# Altium schematic sheet Scheme.SchDoc
size 420 x 297 mm; ListNumber: 1
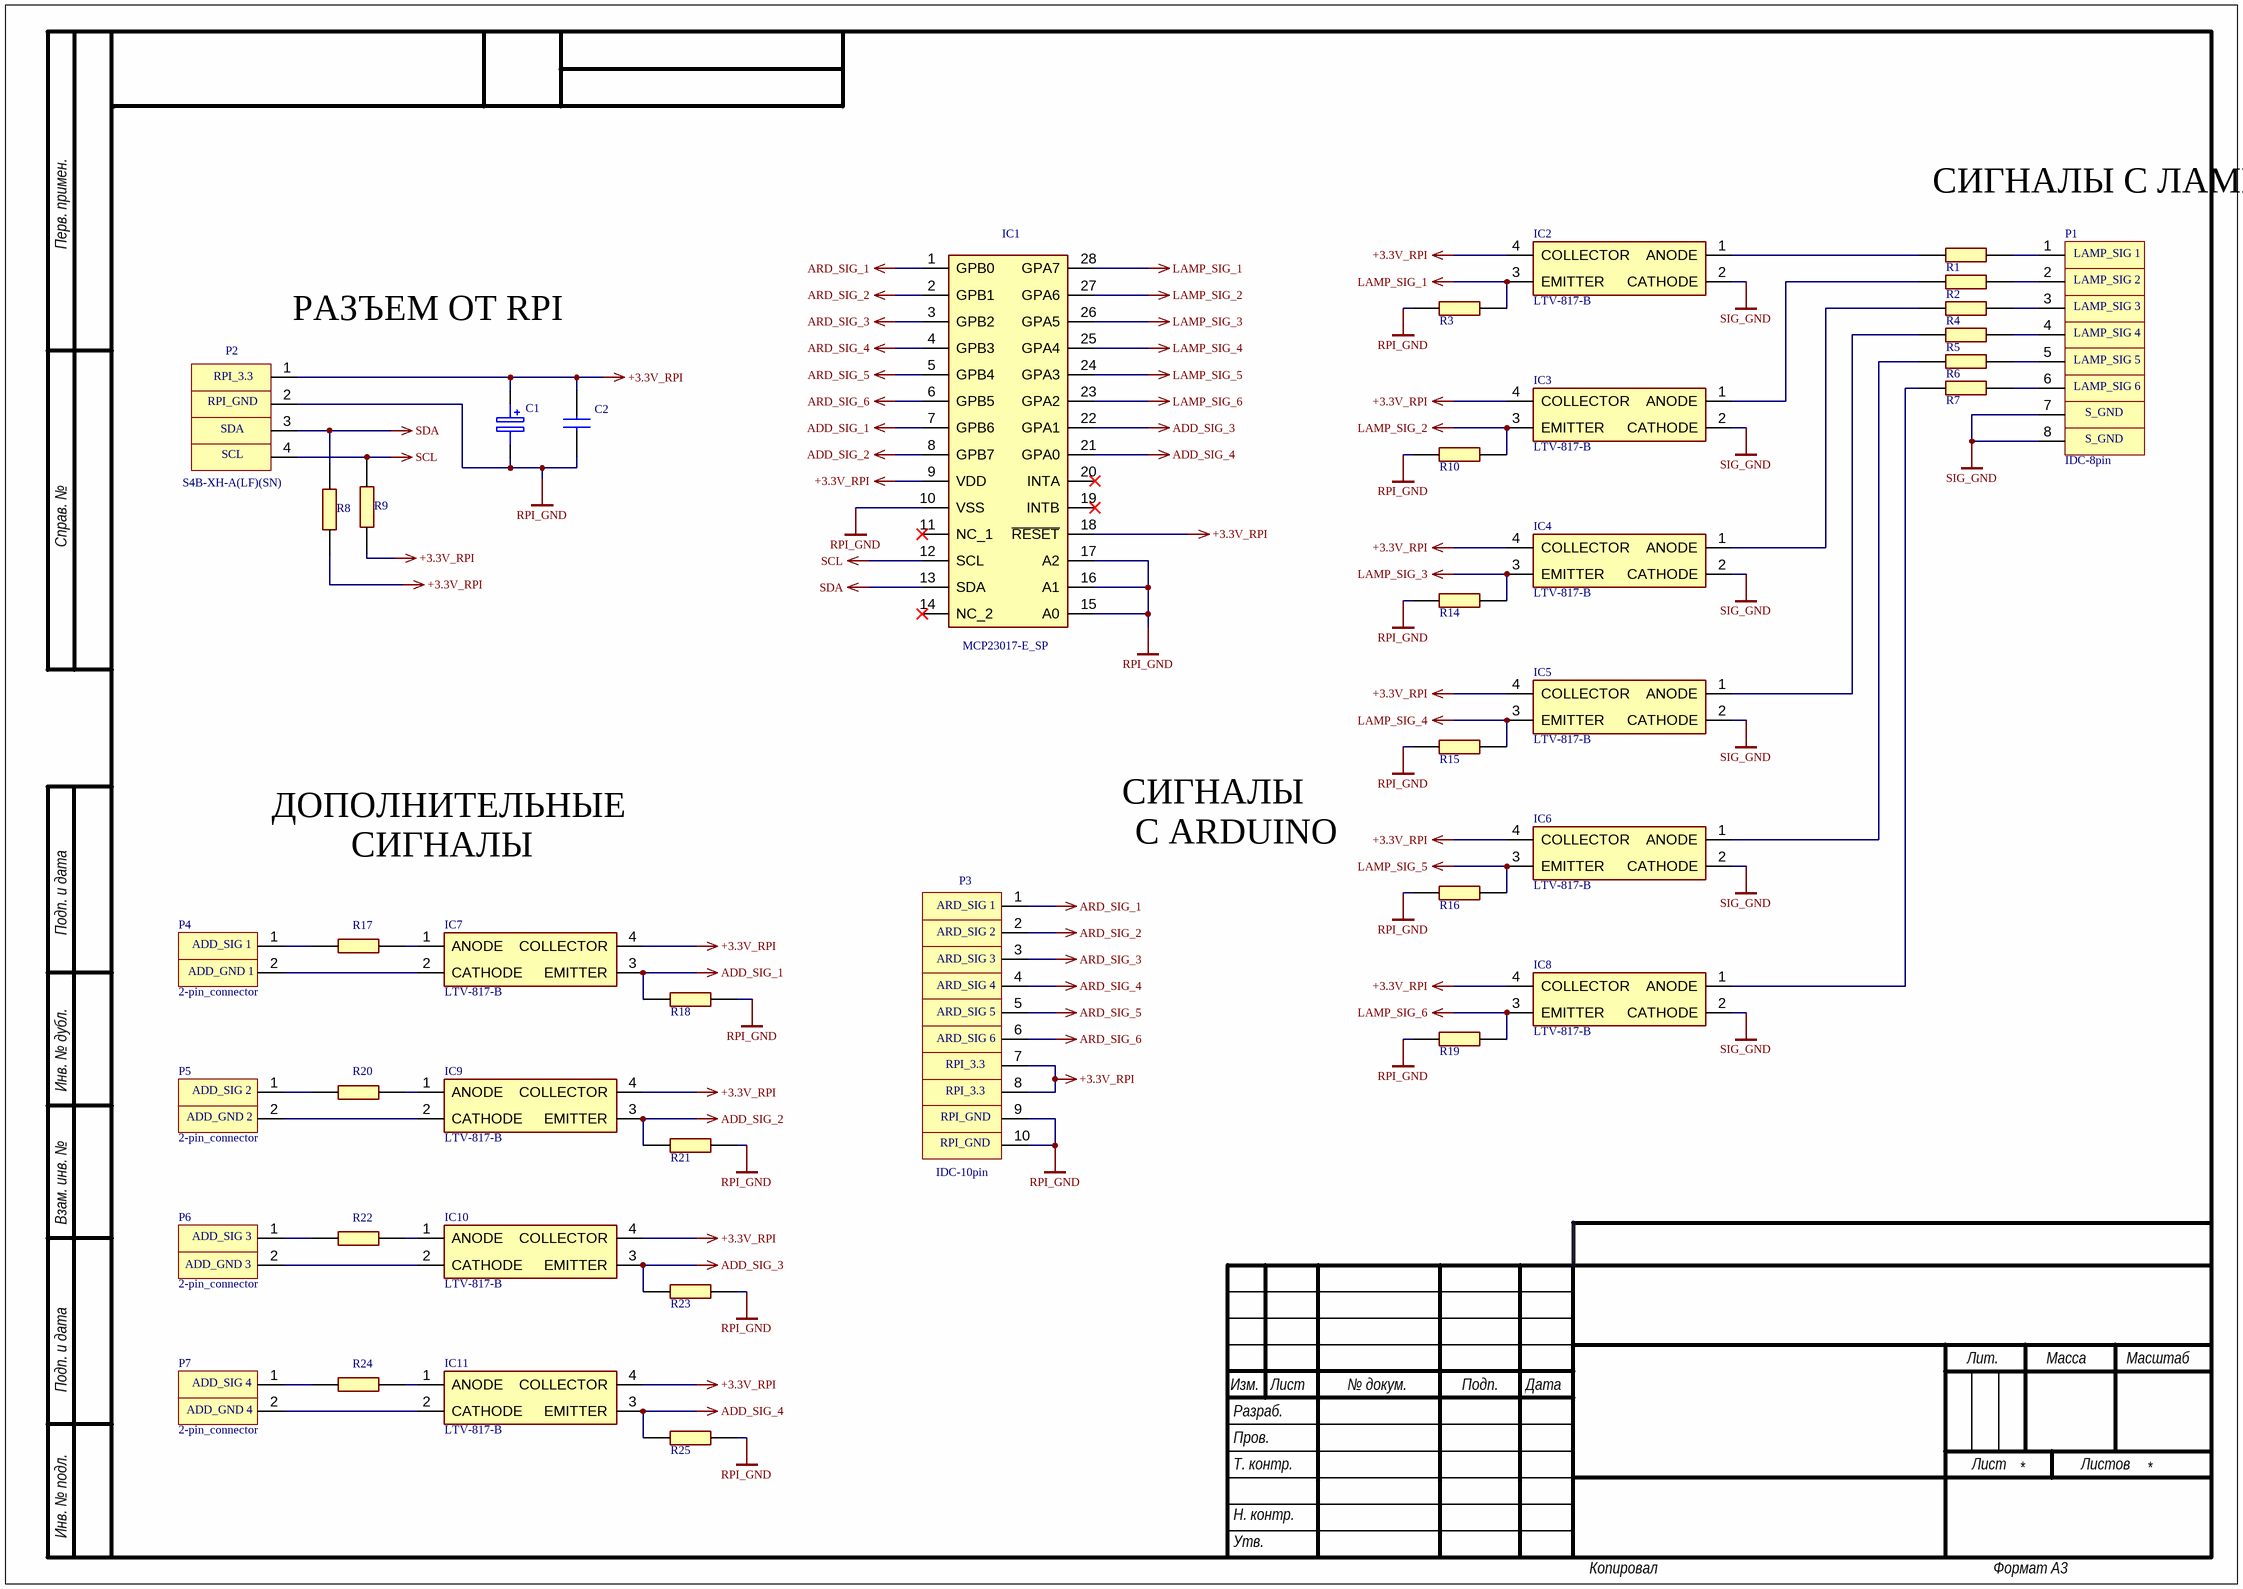
[diagram p0: Scheme.SchDoc]

## Parts
C1  EEU-FR1V330  [CAPPRD200W55D500H1250]  (value not drawn)
C2  C3216C0G1H683J160AE  [CAPC3216X180N]  (value not drawn)
IC1  MCP23017-E_SP  [DIP794W56P254L3486H508Q28N]
IC2  LTV-817-B  [DIP762W60P254L460H420Q4N]
IC3  LTV-817-B  [DIP762W60P254L460H420Q4N]
IC4  LTV-817-B  [DIP762W60P254L460H420Q4N]
IC5  LTV-817-B  [DIP762W60P254L460H420Q4N]
IC6  LTV-817-B  [DIP762W60P254L460H420Q4N]
IC7  LTV-817-B  [DIP762W60P254L460H420Q4N]
IC8  LTV-817-B  [DIP762W60P254L460H420Q4N]
IC9  LTV-817-B  [DIP762W60P254L460H420Q4N]
IC10  LTV-817-B  [DIP762W60P254L460H420Q4N]
IC11  LTV-817-B  [DIP762W60P254L460H420Q4N]
P1  IDC-8pin  [IDC-8pin]
P2  S4B-XH-A(LF)(SN)  [JST-S4B-XH-A(LF)(SN)_V]
P3  IDC-10pin  [IDC-10PIN]
P4  2-pin_connector  [2-pin_connector]
P5  2-pin_connector  [2-pin_connector]
P6  2-pin_connector  [2-pin_connector]
P7  2-pin_connector  [2-pin_connector]
R1  CR1206-FW-1504ELF  [RESC3216X75N]  (value not drawn)
R2  CR1206-FW-1504ELF  [RESC3216X75N]  (value not drawn)
R3  CR1206-FW-1504ELF  [RESC3216X75N]  (value not drawn)
R4  CR1206-FW-1504ELF  [RESC3216X75N]  (value not drawn)
R5  CR1206-FW-1504ELF  [RESC3216X75N]  (value not drawn)
R6  CR1206-FW-1504ELF  [RESC3216X75N]  (value not drawn)
R7  CR1206-FW-1504ELF  [RESC3216X75N]  (value not drawn)
R8  CR1206-FW-1504ELF  [RESC3216X75N]  (value not drawn)
R9  CR1206-FW-1504ELF  [RESC3216X75N]  (value not drawn)
R10  CR1206-FW-1504ELF  [RESC3216X75N]  (value not drawn)
R14  CR1206-FW-1504ELF  [RESC3216X75N]  (value not drawn)
R15  CR1206-FW-1504ELF  [RESC3216X75N]  (value not drawn)
R16  CR1206-FW-1504ELF  [RESC3216X75N]  (value not drawn)
R17  CR1206-FW-1504ELF  [RESC3216X75N]  (value not drawn)
R18  CR1206-FW-1504ELF  [RESC3216X75N]  (value not drawn)
R19  CR1206-FW-1504ELF  [RESC3216X75N]  (value not drawn)
R20  CR1206-FW-1504ELF  [RESC3216X75N]  (value not drawn)
R21  CR1206-FW-1504ELF  [RESC3216X75N]  (value not drawn)
R22  CR1206-FW-1504ELF  [RESC3216X75N]  (value not drawn)
R23  CR1206-FW-1504ELF  [RESC3216X75N]  (value not drawn)
R24  CR1206-FW-1504ELF  [RESC3216X75N]  (value not drawn)
R25  CR1206-FW-1504ELF  [RESC3216X75N]  (value not drawn)

## Nets
+3.3V_RPI: C1.1(+) C2.2 IC1.9(VDD) IC1.18(~{RESET}) IC2.4(COLLECTOR) IC3.4(COLLECTOR) IC4.4(COLLECTOR) IC5.4(COLLECTOR) IC6.4(COLLECTOR) IC7.4(COLLECTOR) IC8.4(COLLECTOR) IC9.4(COLLECTOR) IC10.4(COLLECTOR) IC11.4(COLLECTOR) P2.1 P3.7 P3.8 R8.2 R9.2
ADD_SIG_1: IC1.7(GPB6) IC7.3(EMITTER) R18.1
ADD_SIG_2: IC1.8(GPB7) IC9.3(EMITTER) R21.1
ADD_SIG_3: IC1.22(GPA1) IC10.3(EMITTER) R23.1
ADD_SIG_4: IC1.21(GPA0) IC11.3(EMITTER) R25.1
ARD_SIG_1: IC1.1(GPB0) P3.1
ARD_SIG_2: IC1.2(GPB1) P3.2
ARD_SIG_3: IC1.3(GPB2) P3.3
ARD_SIG_4: IC1.4(GPB3) P3.4
ARD_SIG_5: IC1.5(GPB4) P3.5
ARD_SIG_6: IC1.6(GPB5) P3.6
LAMP_SIG_1: IC1.28(GPA7) IC2.3(EMITTER) R3.1
LAMP_SIG_2: IC1.27(GPA6) IC3.3(EMITTER) R10.1
LAMP_SIG_3: IC1.26(GPA5) IC4.3(EMITTER) R14.1
LAMP_SIG_4: IC1.25(GPA4) IC5.3(EMITTER) R15.1
LAMP_SIG_5: IC1.24(GPA3) IC6.3(EMITTER) R16.1
LAMP_SIG_6: IC1.23(GPA2) IC8.3(EMITTER) R19.1
RPI_GND: C1.2(-) C2.1 IC1.10(VSS) IC1.15(A0) IC1.16(A1) IC1.17(A2) P2.2 P3.9 P3.10 R3.2 R10.2 R14.2 R15.2 R16.2 R18.2 R19.2 R21.2 R23.2 R25.2
SCL: IC1.12(SCL) P2.4 R9.1
SDA: IC1.13(SDA) P2.3 R8.1
SIG_GND: IC2.2(CATHODE) IC3.2(CATHODE) IC4.2(CATHODE) IC5.2(CATHODE) IC6.2(CATHODE) IC8.2(CATHODE) P1.7 P1.8
NetIC2_1: IC2.1(ANODE) R1.1
NetIC3_1: IC3.1(ANODE) R2.1
NetIC4_1: IC4.1(ANODE) R4.1
NetIC5_1: IC5.1(ANODE) R5.1
NetIC6_1: IC6.1(ANODE) R6.1
NetIC7_1: IC7.1(ANODE) R17.2
NetIC7_2: IC7.2(CATHODE) P4.2
NetIC8_1: IC8.1(ANODE) R7.1
NetIC9_1: IC9.1(ANODE) R20.2
NetIC9_2: IC9.2(CATHODE) P5.2
NetIC10_1: IC10.1(ANODE) R22.2
NetIC10_2: IC10.2(CATHODE) P6.2
NetIC11_1: IC11.1(ANODE) R24.2
NetIC11_2: IC11.2(CATHODE) P7.2
NetP1_1: P1.1 R1.2
NetP1_2: P1.2 R2.2
NetP1_3: P1.3 R4.2
NetP1_4: P1.4 R5.2
NetP1_5: P1.5 R6.2
NetP1_6: P1.6 R7.2
NetP4_1: P4.1 R17.1
NetP5_1: P5.1 R20.1
NetP6_1: P6.1 R22.1
NetP7_1: P7.1 R24.1

Not connected (* = marked no-connect by the designer): IC1 11(NC_1)* 14(NC_2)* 19(INTB)* 20(INTA)*

## Notes on the sheet
- СИГНАЛЫ С ЛАМПОЧЕК
- (near P1) LAMP_SIG 1
- РАЗЪЕМ ОТ RPI
- (near P1) LAMP_SIG 2
- (near P1) LAMP_SIG 3
- (near P2) RPI_3.3
- (near P1) LAMP_SIG 4
- (near P1) LAMP_SIG 5
- (near P1) LAMP_SIG 6
- (near P2) RPI_GND
- (near P2) SDA
- (near P2) SCL
- (near P1) S_GND
- ДОПОЛНИТЕЛЬНЫЕ
- СИГНАЛЫ
- (near P3) С ARDUINO
- (near P3) ARD_SIG 1
- (near P3) ARD_SIG 2
- (near P4) ADD_GND 1
- (near P4) ADD_SIG 1
- (near P3) ARD_SIG 3
- (near P3) ARD_SIG 4
- (near P3) ARD_SIG 5
- (near P3) ARD_SIG 6
- (near P3) RPI_3.3
- (near P5) ADD_GND 2
- (near P5) ADD_SIG 2
- (near P3) RPI_GND
- (near P6) ADD_GND 3
- (near P6) ADD_SIG 3
- (near P7) ADD_SIG 4
- (near P7) ADD_GND 4
- Перв. примен.
- Справ. №
- Подп. и дата
- Инв. № дубл.
- Взам. инв. №
- Изм.
- Лист
- № докум.
- Подп.
- Дата
- Лит.
- Масса
- Масштаб
- Разраб.
- Пров.
- Т. контр.
- Листов
- Инв. № подл.
- Н. контр.
- Утв.
- Копировал
- Формат А3

## Library data of the parts
C1 = EEU-FR1V330: Capacitor Polarised; Manufacturer_Name: Panasonic; Datasheet Link: https://componentsearchengine.com/Datasheets/1/EEU-FR1V330.pdf; Height: 12.5mm; Manufacturer_Part_Number: EEU-FR1V330; Mouser Part Number: 667-EEU-FR1V330; Mouser Price/Stock: http://www.mouser.com/Search/ProductDetail.aspx?qs=ob%252bdNz2%252bYEhHeC0uCpfxxQ%3d%3d
C2 = C3216C0G1H683J160AE: Capacitor; Manufacturer_Name: TDK; Datasheet Link: https://product.tdk.com/info/en/catalog/datasheets/mlcc_commercial_midvoltage_en.pdf; Height: 1.8mm; Manufacturer_Part_Number: C3216C0G1H683J160AE; Mouser Part Number: 810-C3216C0G1H683J16; Mouser Price/Stock: https://www.mouser.co.uk/ProductDetail/TDK/C3216C0G1H683J160AE?qs=P1JMDcb91o7iXP%252BmsCRcbg%3D%3D
IC1 = MCP23017-E_SP: Integrated Circuit; Manufacturer_Name: Microchip; Manufacturer_Part_Number: MCP23017-E/SP; Datasheet Link: http://docs-emea.rs-online.com/webdocs/137e/0900766b8137eed4.pdf; Height: 5.08mm; Mouser Part Number: 579-MCP23017-E/SP; Mouser Price/Stock: https://www.mouser.co.uk/ProductDetail/Microchip-Technology/MCP23017-E-SP?qs=usxtMOJb1RyESXZDw7ia5A%3D%3D; Arrow Part Number: MCP23017-E/SP; Arrow Price/Stock: https://www.arrow.com/en/products/mcp23017-esp/microchip-technology
IC2-IC11 = LTV-817-B: Integrated Circuit; Manufacturer_Name: Lite-On; Datasheet Link: http://optoelectronics.liteon.com/upload/download/DS-70-96-0016/LTV-8X7%20series%20201610%20.pdf; Height: 4.2mm; Manufacturer_Part_Number: LTV-817-B; Mouser Part Number: N/A; Mouser Price/Stock: https://www.mouser.co.uk/ProductDetail/Lite-On/LTV-817-B?qs=5Clb0NIqk7HzP4M9tIz87Q%3D%3D; Arrow Part Number: LTV-817-B; Arrow Price/Stock: https://www.arrow.com/en/products/ltv-817-b/lite-on-technology
P2 = S4B-XH-A(LF)(SN): Male Header, Pitch 2.5 mm, 1 x 4 Position, Height 6.1 mm, Tail Length 3.4 mm, -25 to 85 degC, RoHS, Bulk; PackageReference: S4B-XH-A(LF)(SN); ComponentLink1Description: Manufacturer URL; DatasheetVersion: May-16; ComponentLink2Description: Datasheet; ComponentLink2URL: http://www.jst-mfg.com/product/pdf/eng/eXH.pdf; ComponentLink1URL: http://www.jst.com/home2.html; PackageDescription: Male Header, Pitch 2.5 mm, 1 x 4 Position, Height 6.1 mm, Tail Length 3.4 mm
R1-R10 R14-R25 = CR1206-FW-1504ELF: Resistor; Manufacturer_Name: Bourns; Datasheet Link: http://componentsearchengine.com/Datasheets/1/CR1206-FW-1504ELF.pdf; Height: 0.75mm; Manufacturer_Part_Number: CR1206-FW-1504ELF; Mouser Part Number: 652-CR1206FW1504ELF; Mouser Price/Stock: https://www.mouser.co.uk/ProductDetail/Bourns/CR1206-FW-1504ELF/?qs=6oMev5NRZMFfvXkOpYL2%252BA%3D%3D; Arrow Part Number: CR1206-FW-1504ELF; Arrow Price/Stock: https://www.arrow.com/en/products/cr1206-fw-1504elf/bourns
P1 = IDC-8pin: PackageReference: IDC-8pin; ComponentLink1Description: Manufacturer URL; DatasheetVersion: May-16; ComponentLink2Description: Datasheet
P3 = IDC-10pin: PackageReference: IDC-8pin; ComponentLink1Description: Manufacturer URL; DatasheetVersion: May-16; ComponentLink2Description: Datasheet
P4-P7 = 2-pin_connector: ComponentLink1Description: Manufacturer URL; DatasheetVersion: May-16; ComponentLink2Description: Datasheet